# Altium project Light Control BigOne.PrjPcb
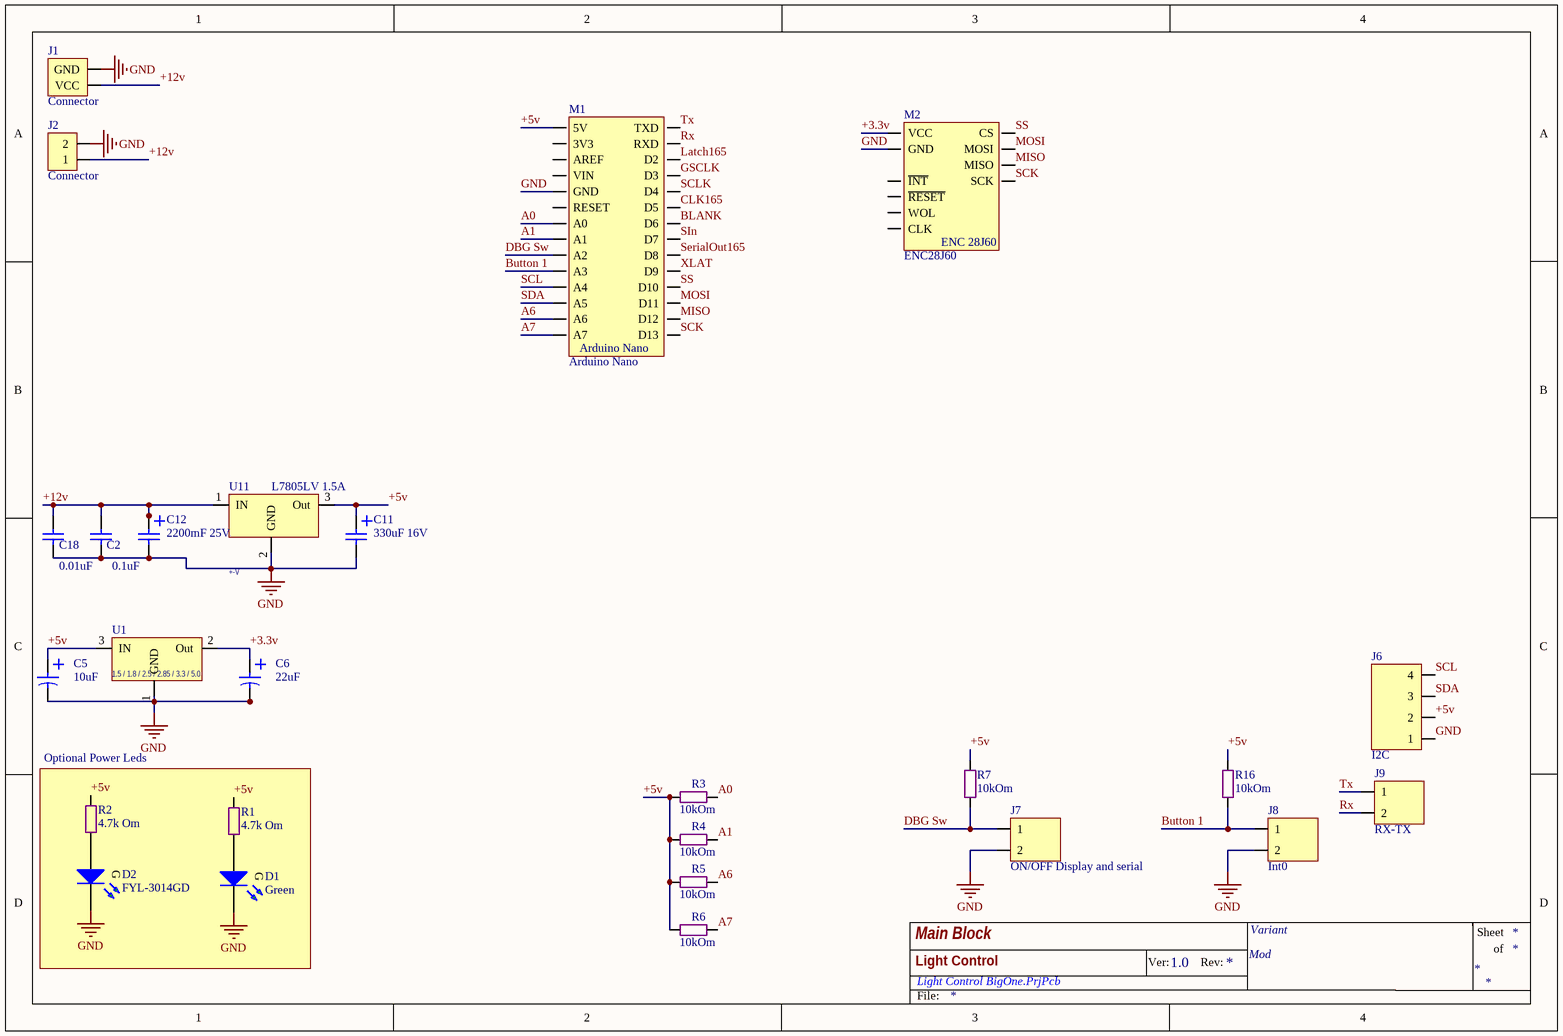
[diagram p0: LC BigOne - MainBlock.SchDoc]
6 sheets, 194 parts. Net scope: global (net labels, ports and power ports of the same name join across sheets).
Board file: LC BigOne.PcbDoc
Sheets:
  LC BigOne - MainBlock.SchDoc
  LC BigOne - TLC5940 driver.SchDoc
  LC BigOne - 165 SerialIn Register (v2).SchDoc
  LC BigOne - Comm Connectors.SchDoc
  LC BigOne - 5.3A MOSFET for TLC5940 2.SchDoc
  LC BigOne - 5.3A MOSFET for TLC5940 3.SchDoc

## Sheet LC BigOne - MainBlock.SchDoc: Main Block
size A4; Version: 1.0; Variant: Variant; Modification: Mod; Project: Light Control; PageSetup: Record=PageOptions|CenterHorizontal=True|CenterVertical=True|PrintScale=0.97|XCorrection=1.00|YCorrection=1.00|PrintKind=1|BorderSize=5000000|LeftOffset=0|BottomOffset=0|Orientation=2|PaperLength=2970|PaperWidth=2100|Scale=100|PaperSource=7|PrintQuality=-4|MediaType=1|DitherType=10|PaperKind=A4|PrintScaleMode=1

### Parts
C2  0.1uF  [SMD 0805 (2012)]
C5  10uF  [SMD 1206 Tantal (3216)]
C6  22uF  [SMD 3528 Tantal (1210)]
C11  330uF 16V  [Cap E p3.5mm D8xH12]
C12  2200mF 25V  [Cap E p5.08mm D10.2mm (3p) R]
C18  0.01uF  [SMD 0805 (2012)]
D1  Green  [LED SMD 0805 Green]
D2  FYL-3014GD  [LED Round 3mm Green]
J1  Connector  [DC Connector]
J2  Connector  [DG301 5mm 2p]
J6  I2C  [Line 2.54 X 4]
J7  ON/OFF Display and serial  [Line 2.54 x 2]
J8  Int0  [Line 2.54 x 2]
J9  RX-TX  [Line 2.54 x 2]
M1  Arduino Nano  [Arduino Nano]
M2  ENC28J60  [ENC28J60 MiNi]
R1  4.7k Om  [SMD 0805 (2012)]
R2  4.7k Om  [SMD 0805 (2012)]
R3  10kOm  [SMD 0805 (2012)]
R4  10kOm  [SMD 0805 (2012)]
R5  10kOm  [SMD 0805 (2012)]
R6  10kOm  [SMD 0805 (2012)]
R7  10kOm  [SMD 0805 (2012)]
R16  10kOm  [SMD 0805 (2012)]
U1  V Out: 1.5 / 1.8 / 2.5 / 2.85 / 3.3 / 5.0  [SOT-223-3 (AMS)]  (hidden comment: AMS1117 1.5 / 1.8 / 2.5 / 2.85 / 3.3 / 5.0)
U11  L7805LV 1.5A  V Out: +-V  [TO220 L]

### Blocks framed on the sheet
Optional Power Leds: D1 D2 R1 R2

### Nets
+5v: C5.VCC C11.1 J6.2 M1.5V R1.1 R2.1 R3.2 R4.2 R5.2 R6.2 R7.2 R16.2 U1.3(IN) U11.3(Out)
GND: C2.2 C5.GND C6.GND C11.2 C12.2 C18.2 D1.K D2.K J1.GND J2.2 J6.1 J7.2 J8.2 M1.GND M2.GND U1.1(GND) U11.2(GND)
+3.3v: C6.VCC M2.VCC U1.2(Out)
+12v: C2.1 C12.1 C18.1 J1.VCC J2.1 U11.1(IN)
A0: M1.A0 R3.1
A1: M1.A1 R4.1
A6: M1.A6 R5.1
A7: M1.A7 R6.1
BLANK: M1.D6
Button 1: J8.1 M1.A3 R16.1
CLK165: M1.D5
DBG Sw: J7.1 M1.A2 R7.1
GSCLK: M1.D3
Latch165: M1.D2
MISO: M1.D12 M2.MISO
MOSI: M1.D11 M2.MOSI
Rx: J9.2 M1.RXD
SCK: M1.D13 M2.SCK
SCL: J6.4 M1.A4
SCLK: M1.D4
SDA: J6.3 M1.A5
SerialOut165: M1.D8
SIn: M1.D7
SS: M1.D10 M2.CS
Tx: J9.1 M1.TXD
XLAT: M1.D9
NetD1_A: D1.A R1.2
NetD2_A: D2.A R2.2

Not connected (* = marked no-connect by the designer): M1 3V3 AREF RESET VIN; M2 CLK INT(~{INT}) RESET(~{RESET}) WOL

### Notes on the sheet
- Ver:
- Rev:
- Sheet
- of
- File:
- (in symbol ENC28J60) ENC 28J60
- (in symbol Led Round 3mm Green) G
- (in symbol Led SMD Green) G

### Library data of the parts
C2 C18 = Cap SMD 0402-1812: Capacitor
C5 C6 = Cap Tantal: Capacitor
C11 = Cap E 330uF x 16V: Capacitor
C12 = Cap E 2200mF x 16V: Capacitor
D1 = Led SMD Green: ?2v ?20mA; Forward Voltage TYP: ?2; Resistor for 5v VCC: 330 Om; Forward Voltage Min: ?; Wave len min/typ: ?; Liminous Min (mcd): ?; Liminous Typ (mcd): ?; Forward Amp (mA): ?; Color: Green
D2 = Led Round 3mm Green: 2.1v 10mA, 15-30mCd; Forward Voltage Max: 2.3; Forward Voltage TYP: 2.1; Wave len min/typ: 570nm; Liminous Typ (mcd): 15-30; Forward Amp (mA): 10; Color: Green; Name: FYL-3014GD
J1 = DC Connector (PJ-002B): DC Connector; Ext Pin Diameter: 5.5mm; Int Pin Diameter: 2.5
J2 = DG301-5.0-2P12: DG301 series
J6 = PLS-4: Vert, Sgl line, Male
J7-J9 = PLS-2: Vert, Sgl line, Male
R1-R7 R16 = Res All Types
U1 = AMS1117_FIX: Voltage Regulator SOT-223-3; I output (A): 1; Max Voltage In (V): 15; t: -40...+125°C; Dropuot: 1-1.3V; Capacitors: In: 10mF; Out: 22mF; Case: SOT-223; Name: AMS1117 1.5 / 1.8 / 2.5 / 2.85 / 3.3 / 5.0; Dtatsheet: https://lib.chipdip.ru/029/DOC001029248.pdf
U11 = KPEH: Linear Voltage Regulator; t: 0...+150°C; Case: TO220; Name: Linear Voltage Regulator
M2 = ENC28J60: ENC28J60 Chip Datasheet: http://lib.chipdip.ru/286/doc000286027.pdf

## Sheet LC BigOne - TLC5940 driver.SchDoc: DBL TLC5940 driver for High load
size A4; Revision: 0; SheetNumber: 1; SheetTotal: 2; Version: 1.0; Variant: Variant; Modification: Mod; Project: Light Control; PageSetup: Record=PageOptions|CenterHorizontal=True|CenterVertical=True|PrintScale=0.97|XCorrection=1.00|YCorrection=1.00|PrintKind=1|BorderSize=5000000|LeftOffset=0|BottomOffset=0|Orientation=2|PaperLength=2970|PaperWidth=2100|Scale=100|PaperSource=7|PrintQuality=-4|MediaType=1|DitherType=10|PaperKind=A4|PrintScaleMode=1
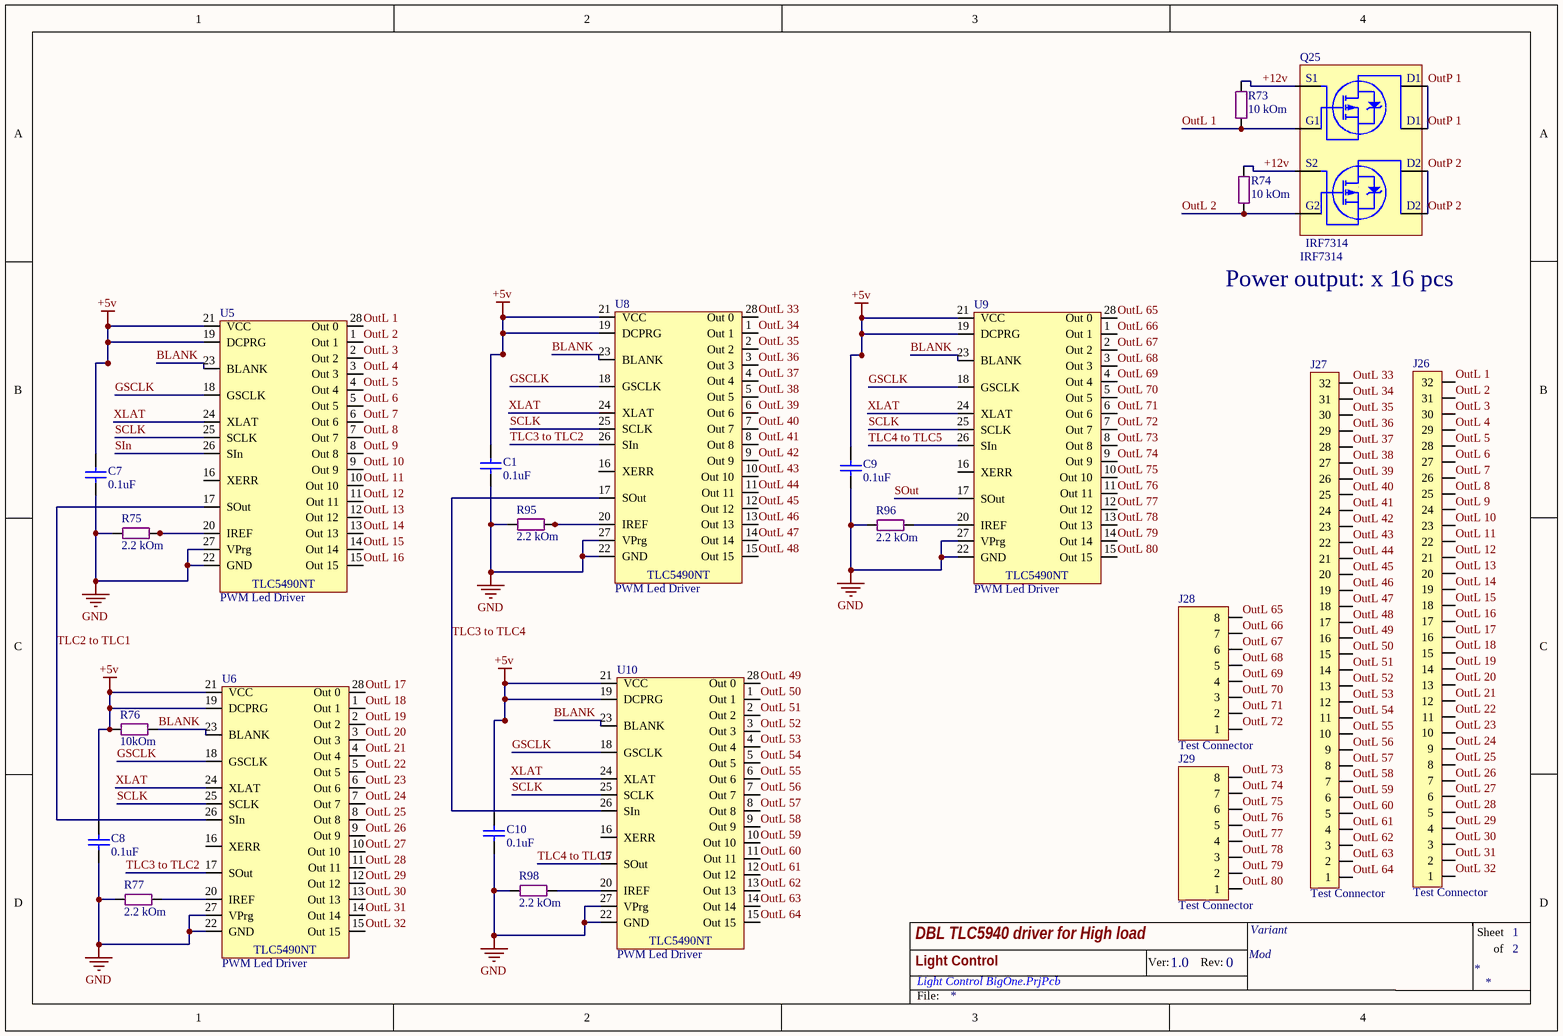
[diagram p1: LC BigOne - TLC5940 driver.SchDoc]

### Parts
C1  0.1uF  [SMD 0805 (2012)]
C7  0.1uF  [SMD 0805 (2012)]
C8  0.1uF  [SMD 0805 (2012)]
C9  0.1uF  [SMD 0805 (2012)]
C10  0.1uF  [SMD 0805 (2012)]
J26  Test Connector  [LINE 2.54 x 32]
J27  Test Connector  [LINE 2.54 x 32]
J28  Test Connector  [Line 2.54 x 8]
J29  Test Connector  [Line 2.54 x 8]
Q25  IRF7314  [SO8]
R73  10 kOm  [SMD 0805 (2012)]
R74  10 kOm  [SMD 0805 (2012)]
R75  2.2 kOm  [SMD 0805 (2012)]
R76  10kOm  [SMD 0805 (2012)]
R77  2.2 kOm  [SMD 0805 (2012)]
R95  2.2 kOm  [SMD 0805 (2012)]
R96  2.2 kOm  [SMD 0805 (2012)]
R98  2.2 kOm  [SMD 0805 (2012)]
U5  PWM Led Driver  [DIP-28 (OVAL)]
U6  PWM Led Driver  [DIP-28 (OVAL)]
U8  PWM Led Driver  [DIP-28 (OVAL)]
U9  PWM Led Driver  [DIP-28 (OVAL)]
U10  PWM Led Driver  [DIP-28 (OVAL)]

### Nets
+5v: C1.1 C7.1 C8.1 C9.1 C10.1 R76.1 U5.19(DCPRG) U5.21(VCC) U6.19(DCPRG) U6.21(VCC) U8.19(DCPRG) U8.21(VCC) U9.19(DCPRG) U9.21(VCC) U10.19(DCPRG) U10.21(VCC)
GND: C1.2 C7.2 C8.2 C9.2 C10.2 R75.2 R77.2 R95.2 R96.2 R98.2 U5.22(GND) U5.27(VPrg) U6.22(GND) U6.27(VPrg) U8.22(GND) U8.27(VPrg) U9.22(GND) U9.27(VPrg) U10.22(GND) U10.27(VPrg)
+12v: Q25.1(S) Q25.3(S) R73.2 R74.2
BLANK: R76.2 U5.23(BLANK) U6.23(BLANK) U8.23(BLANK) U9.23(BLANK) U10.23(BLANK)
GSCLK: U5.18(GSCLK) U6.18(GSCLK) U8.18(GSCLK) U9.18(GSCLK) U10.18(GSCLK)
OutL 1: J26.32 Q25.2(G) R73.1 U5.28(Out_0)
OutL 2: J26.31 Q25.4(G) R74.1 U5.1(Out_1)
OutL 3: J26.30 U5.2(Out_2)
OutL 4: J26.29 U5.3(Out_3)
OutL 5: J26.28 U5.4(Out_4)
OutL 6: J26.27 U5.5(Out_5)
OutL 7: J26.26 U5.6(Out_6)
OutL 8: J26.25 U5.7(Out_7)
OutL 9: J26.24 U5.8(Out_8)
OutL 10: J26.23 U5.9(Out_9)
OutL 11: J26.22 U5.10(Out_10)
OutL 12: J26.21 U5.11(Out_11)
OutL 13: J26.20 U5.12(Out_12)
OutL 14: J26.19 U5.13(Out_13)
OutL 15: J26.18 U5.14(Out_14)
OutL 16: J26.17 U5.15(Out_15)
OutL 17: J26.16 U6.28(Out_0)
OutL 18: J26.15 U6.1(Out_1)
OutL 19: J26.14 U6.2(Out_2)
OutL 20: J26.13 U6.3(Out_3)
OutL 21: J26.12 U6.4(Out_4)
OutL 22: J26.11 U6.5(Out_5)
OutL 23: J26.10 U6.6(Out_6)
OutL 24: J26.9 U6.7(Out_7)
OutL 25: J26.8 U6.8(Out_8)
OutL 26: J26.7 U6.9(Out_9)
OutL 27: J26.6 U6.10(Out_10)
OutL 28: J26.5 U6.11(Out_11)
OutL 29: J26.4 U6.12(Out_12)
OutL 30: J26.3 U6.13(Out_13)
OutL 31: J26.2 U6.14(Out_14)
OutL 32: J26.1 U6.15(Out_15)
OutL 33: J27.32 U8.28(Out_0)
OutL 34: J27.31 U8.1(Out_1)
OutL 35: J27.30 U8.2(Out_2)
OutL 36: J27.29 U8.3(Out_3)
OutL 37: J27.28 U8.4(Out_4)
OutL 38: J27.27 U8.5(Out_5)
OutL 39: J27.26 U8.6(Out_6)
OutL 40: J27.25 U8.7(Out_7)
OutL 41: J27.24 U8.8(Out_8)
OutL 42: J27.23 U8.9(Out_9)
OutL 43: J27.22 U8.10(Out_10)
OutL 44: J27.21 U8.11(Out_11)
OutL 45: J27.20 U8.12(Out_12)
OutL 46: J27.19 U8.13(Out_13)
OutL 47: J27.18 U8.14(Out_14)
OutL 48: J27.17 U8.15(Out_15)
OutL 49: J27.16 U10.28(Out_0)
OutL 50: J27.15 U10.1(Out_1)
OutL 51: J27.14 U10.2(Out_2)
OutL 52: J27.13 U10.3(Out_3)
OutL 53: J27.12 U10.4(Out_4)
OutL 54: J27.11 U10.5(Out_5)
OutL 55: J27.10 U10.6(Out_6)
OutL 56: J27.9 U10.7(Out_7)
OutL 57: J27.8 U10.8(Out_8)
OutL 58: J27.7 U10.9(Out_9)
OutL 59: J27.6 U10.10(Out_10)
OutL 60: J27.5 U10.11(Out_11)
OutL 61: J27.4 U10.12(Out_12)
OutL 62: J27.3 U10.13(Out_13)
OutL 63: J27.2 U10.14(Out_14)
OutL 64: J27.1 U10.15(Out_15)
OutL 65: J28.8 U9.28(Out_0)
OutL 66: J28.7 U9.1(Out_1)
OutL 67: J28.6 U9.2(Out_2)
OutL 68: J28.5 U9.3(Out_3)
OutL 69: J28.4 U9.4(Out_4)
OutL 70: J28.3 U9.5(Out_5)
OutL 71: J28.2 U9.6(Out_6)
OutL 72: J28.1 U9.7(Out_7)
OutL 73: J29.8 U9.8(Out_8)
OutL 74: J29.7 U9.9(Out_9)
OutL 75: J29.6 U9.10(Out_10)
OutL 76: J29.5 U9.11(Out_11)
OutL 77: J29.4 U9.12(Out_12)
OutL 78: J29.3 U9.13(Out_13)
OutL 79: J29.2 U9.14(Out_14)
OutL 80: J29.1 U9.15(Out_15)
OutP 1: Q25.7(D) Q25.8(D)
OutP 2: Q25.5(D) Q25.6(D)
SCLK: U5.25(SCLK) U6.25(SCLK) U8.25(SCLK) U9.25(SCLK) U10.25(SCLK)
SIn: U5.26(SIn)
SOut: U9.17(SOut)
TLC2 to TLC1: U5.17(SOut) U6.26(SIn)
TLC3 to TLC2: U6.17(SOut) U8.26(SIn)
TLC3 to TLC4: U8.17(SOut) U10.26(SIn)
TLC4 to TLC5: U9.26(SIn) U10.17(SOut)
XLAT: U5.24(XLAT) U6.24(XLAT) U8.24(XLAT) U9.24(XLAT) U10.24(XLAT)
NetR75_1: R75.1 U5.20(IREF)
NetR77_1: R77.1 U6.20(IREF)
NetR95_1: R95.1 U8.20(IREF)
NetR96_1: R96.1 U9.20(IREF)
NetR98_1: R98.1 U10.20(IREF)

Not connected (* = marked no-connect by the designer): U5 16(XERR); U6 16(XERR); U8 16(XERR); U9 16(XERR); U10 16(XERR)

### Notes on the sheet
- Power output: x 16 pcs
- Ver:
- Rev:
- Sheet
- of
- File:
- (in symbol IRF7314) S1; D1; G1; S2; D2; G2
- (in symbol TLC5940) TLC5490NT

### Library data of the parts
C1 C7-C10 = Cap SMD 0402-1812: Capacitor
J26 J27 = PLS-32: Vert, Sgl line, Male
J28 J29 = PLS-8: Vert, Sgl line, Male
Q25 = IRF7314: Dual P-Ch  20V - 0.058Ω - 5.3A; Monufacturer: IOR; RDS Сопротивление Сток-Исток: 0.058 Om; I d - Drain current (continuous) at TC = 100°C: 4.3 A; VGS Порог Открытия: -0.7 V; VGS Макс напр на гейте: +-12 V; C ISS Входная емкость: 780 pF; C OSS Выходная емкость: 470 pF; V DSS (v): 20V; I d - Drain current (continuous) at TC = 25°C: 5.3 A; Name: IRF7314; Datasheet: http://tec.org.ru/_bd/2/277_IRF7314-IR.pdf; URL: http://tec.org.ru/board/49-1-0-277
R73-R77 R95 R96 R98 = Res All Types
U5 U6 U8-U10 = TLC5940: 16-Channel LED Driver With DOT Correction and Grayscale PWM Control; DataSheet: http://www.ti.com/lit/ds/symlink/tlc5940.pdf

## Sheet LC BigOne - 165 SerialIn Register (v2).SchDoc: DBL 165 Serial In Register
size A4; Organization: Controlled by GND; Revision: 0; SheetNumber: 1; SheetTotal: 1; Version: 2.0s; Variant: Controlled by GND; Modification: On IRF5850 Mosfet; Project: Light Control; PageSetup: Record=PageOptions|CenterHorizontal=True|CenterVertical=True|PrintScale=0.97|XCorrection=1.00|YCorrection=1.00|PrintKind=1|BorderSize=5000000|LeftOffset=0|BottomOffset=0|Orientation=2|PaperLength=2970|PaperWidth=2100|Scale=100|PaperSource=7|PrintQuality=-4|MediaType=1|DitherType=10|PaperKind=A4|PrintScaleMode=1; DocumentName: DBL 165 Serial In Register; ProjectName: LightControl
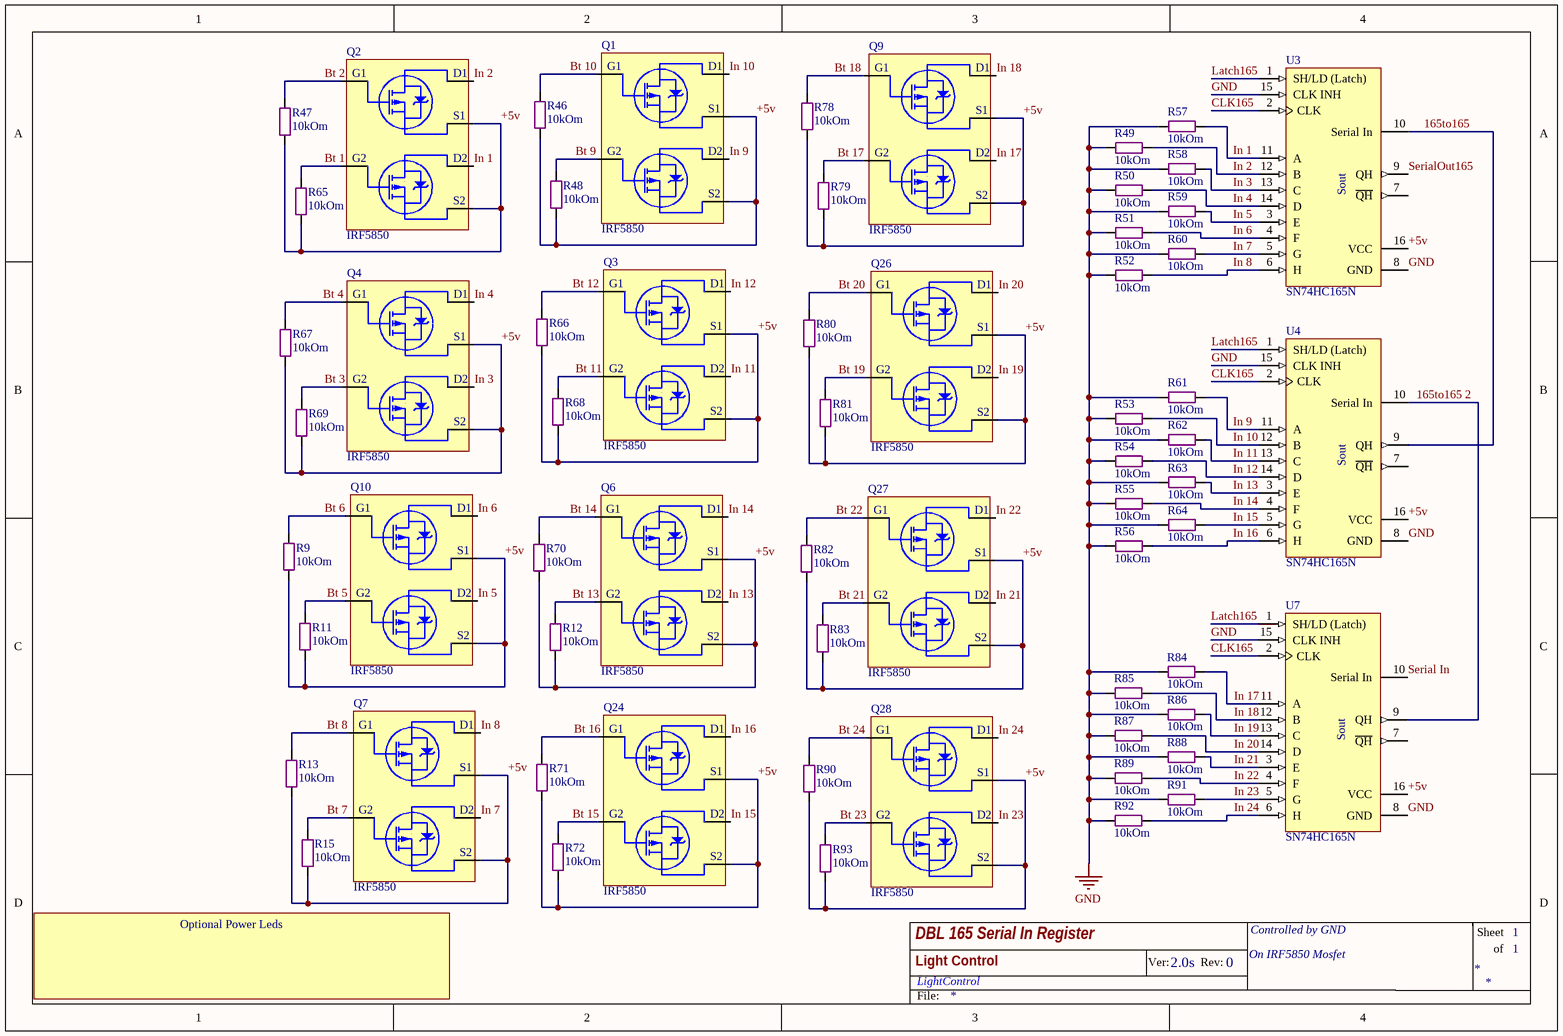
[diagram p2: LC BigOne - 165 SerialIn Register (v2).SchDoc]

### Parts
Q1  IRF5850  [TSOP-6]
Q2  IRF5850  [TSOP-6]
Q3  IRF5850  [TSOP-6]
Q4  IRF5850  [TSOP-6]
Q6  IRF5850  [TSOP-6]
Q7  IRF5850  [TSOP-6]
Q9  IRF5850  [TSOP-6]
Q10  IRF5850  [TSOP-6]
Q24  IRF5850  [TSOP-6]
Q26  IRF5850  [TSOP-6]
Q27  IRF5850  [TSOP-6]
Q28  IRF5850  [TSOP-6]
R9  10kOm  [SMD 0805 (2012)]
R11  10kOm  [SMD 0805 (2012)]
R12  10kOm  [SMD 0805 (2012)]
R13  10kOm  [SMD 0805 (2012)]
R15  10kOm  [SMD 0805 (2012)]
R46  10kOm  [SMD 0805 (2012)]
R47  10kOm  [SMD 0805 (2012)]
R48  10kOm  [SMD 0805 (2012)]
R49  10kOm  [SMD 0805 (2012)]
R50  10kOm  [SMD 0805 (2012)]
R51  10kOm  [SMD 0805 (2012)]
R52  10kOm  [SMD 0805 (2012)]
R53  10kOm  [SMD 0805 (2012)]
R54  10kOm  [SMD 0805 (2012)]
R55  10kOm  [SMD 0805 (2012)]
R56  10kOm  [SMD 0805 (2012)]
R57  10kOm  [SMD 0805 (2012)]
R58  10kOm  [SMD 0805 (2012)]
R59  10kOm  [SMD 0805 (2012)]
R60  10kOm  [SMD 0805 (2012)]
R61  10kOm  [SMD 0805 (2012)]
R62  10kOm  [SMD 0805 (2012)]
R63  10kOm  [SMD 0805 (2012)]
R64  10kOm  [SMD 0805 (2012)]
R65  10kOm  [SMD 0805 (2012)]
R66  10kOm  [SMD 0805 (2012)]
R67  10kOm  [SMD 0805 (2012)]
R68  10kOm  [SMD 0805 (2012)]
R69  10kOm  [SMD 0805 (2012)]
R70  10kOm  [SMD 0805 (2012)]
R71  10kOm  [SMD 0805 (2012)]
R72  10kOm  [SMD 0805 (2012)]
R78  10kOm  [SMD 0805 (2012)]
R79  10kOm  [SMD 0805 (2012)]
R80  10kOm  [SMD 0805 (2012)]
R81  10kOm  [SMD 0805 (2012)]
R82  10kOm  [SMD 0805 (2012)]
R83  10kOm  [SMD 0805 (2012)]
R84  10kOm  [SMD 0805 (2012)]
R85  10kOm  [SMD 0805 (2012)]
R86  10kOm  [SMD 0805 (2012)]
R87  10kOm  [SMD 0805 (2012)]
R88  10kOm  [SMD 0805 (2012)]
R89  10kOm  [SMD 0805 (2012)]
R90  10kOm  [SMD 0805 (2012)]
R91  10kOm  [SMD 0805 (2012)]
R92  10kOm  [SMD 0805 (2012)]
R93  10kOm  [SMD 0805 (2012)]
U3  SN74HC165N  [DIP-16]
U4  SN74HC165N  [DIP-16]
U7  SN74HC165N  [DIP-16]

### Nets
+5v: Q1.2(S2) Q1.5(S1) Q2.2(S2) Q2.5(S1) Q3.2(S2) Q3.5(S1) Q4.2(S2) Q4.5(S1) Q6.2(S2) Q6.5(S1) Q7.2(S2) Q7.5(S1) Q9.2(S2) Q9.5(S1) Q10.2(S2) Q10.5(S1) Q24.2(S2) Q24.5(S1) Q26.2(S2) Q26.5(S1) Q27.2(S2) Q27.5(S1) Q28.2(S2) Q28.5(S1) R9.2 R11.2 R12.2 R13.2 R15.2 R46.2 R47.2 R48.2 R65.2 R66.2 R67.2 R68.2 R69.2 R70.2 R71.2 R72.2 R78.2 R79.2 R80.2 R81.2 R82.2 R83.2 R90.2 R93.2 U3.16(VCC) U4.16(VCC) U7.16(VCC)
GND: R49.1 R50.1 R51.1 R52.1 R53.1 R54.1 R55.1 R56.1 R57.1 R58.1 R59.1 R60.1 R61.1 R62.1 R63.1 R64.1 R84.1 R85.1 R86.1 R87.1 R88.1 R89.1 R91.1 R92.1 U3.8(GND) U3.15(CLK_INH) U4.8(GND) U4.15(CLK_INH) U7.8(GND) U7.15(CLK_INH)
165to165: U3.10(Serial_In) U4.9(QH)
165to165 2: U4.10(Serial_In) U7.9(QH)
Bt 1: Q2.3(G2) R65.1
Bt 2: Q2.1(G1) R47.1
Bt 3: Q4.3(G2) R69.1
Bt 4: Q4.1(G1) R67.1
Bt 5: Q10.3(G2) R11.1
Bt 6: Q10.1(G1) R9.1
Bt 7: Q7.3(G2) R15.1
Bt 8: Q7.1(G1) R13.1
Bt 9: Q1.3(G2) R48.1
Bt 10: Q1.1(G1) R46.1
Bt 11: Q3.3(G2) R68.1
Bt 12: Q3.1(G1) R66.1
Bt 13: Q6.3(G2) R12.1
Bt 14: Q6.1(G1) R70.1
Bt 15: Q24.3(G2) R72.1
Bt 16: Q24.1(G1) R71.1
Bt 17: Q9.3(G2) R79.1
Bt 18: Q9.1(G1) R78.1
Bt 19: Q26.3(G2) R81.1
Bt 20: Q26.1(G1) R80.1
Bt 21: Q27.3(G2) R83.1
Bt 22: Q27.1(G1) R82.1
Bt 23: Q28.3(G2) R93.1
Bt 24: Q28.1(G1) R90.1
CLK165: U3.2(CLK) U4.2(CLK) U7.2(CLK)
In 1: Q2.4(D2) R57.2 U3.11(A)
In 2: Q2.6(D1) R49.2 U3.12(B)
In 3: Q4.4(D2) R58.2 U3.13(C)
In 4: Q4.6(D1) R50.2 U3.14(D)
In 5: Q10.4(D2) R59.2 U3.3(E)
In 6: Q10.6(D1) R51.2 U3.4(F)
In 7: Q7.4(D2) R60.2 U3.5(G)
In 8: Q7.6(D1) R52.2 U3.6(H)
In 9: Q1.4(D2) R61.2 U4.11(A)
In 10: Q1.6(D1) R53.2 U4.12(B)
In 11: Q3.4(D2) R62.2 U4.13(C)
In 12: Q3.6(D1) R54.2 U4.14(D)
In 13: Q6.4(D2) R63.2 U4.3(E)
In 14: Q6.6(D1) R55.2 U4.4(F)
In 15: Q24.4(D2) R64.2 U4.5(G)
In 16: Q24.6(D1) R56.2 U4.6(H)
In 17: Q9.4(D2) R84.2 U7.11(A)
In 18: Q9.6(D1) R85.2 U7.12(B)
In 19: Q26.4(D2) R86.2 U7.13(C)
In 20: Q26.6(D1) R87.2 U7.14(D)
In 21: Q27.4(D2) R88.2 U7.3(E)
In 22: Q27.6(D1) R89.2 U7.4(F)
In 23: Q28.4(D2) R91.2 U7.5(G)
In 24: Q28.6(D1) R92.2 U7.6(H)
Latch165: U3.1(SH/LD_(Latch)) U4.1(SH/LD_(Latch)) U7.1(SH/LD_(Latch))
Serial In: U7.10(Serial_In)
SerialOut165: U3.9(QH)

Not connected (* = marked no-connect by the designer): U3 7(~{QH}); U4 7(~{QH}); U7 7(~{QH})

### Notes on the sheet
- Optional Power Leds
- Ver:
- Rev:
- Sheet
- of
- File:
- (in symbol SN74HC165N) Sout

### Library data of the parts
Q1-Q4 Q6 Q7 Q9 Q10 Q24 Q26-Q28 = IRF5850: Dual P-Ch  20V - 0.135Ω - 2.2A; Monufacturer: IOR; V DSS (v): -20 V; RDS Сопротивление Сток-Исток: 0.135 Om; I d - Drain current (continuous) at TC = 70°C: 1.8 A; VGS Порог Открытия: -0.45...-1.2 V; VGS Макс напр на гейте: +-12 V; C ISS Входная емкость: 320 pF; C OSS Выходная емкость: 56 pF; I d - Drain current (continuous) at TC = 25°C: 2.2 A; Name: IRF5850; Datasheet: http://tec.org.ru/_bd/4/490_IRF5850.pdf; URL: http://tec.org.ru/board/irf5850/49-1-0-490
R9 R11-R13 R15 R46-R72 R78-R93 = Res All Types
U3 U4 U7 = SN74HC165N: 8-Bit Parallel-Load Shift Register; Published: 8-Jun-2000; LatestRevisionDate: 04-Mar-2005; LatestRevisionNote: Stylized 3D Model Added.; DatasheetVersion: May-1997; PackageVersion: Oct-1995; PackageReference: N016; Publisher: Altium Limited; PackageDescription: DIP; 16 Leads; Row Spacing 7.62 mm; Pitch 2.54 mm; Code_JEDEC: MS-001-BB; ComponentLink1Description: Manufacturer Link; ComponentLink1URL: http://www.ti.com/; ComponentLink2Description: Datasheet; ComponentLink2URL: http://www-s.ti.com/sc/ds/sn74hc165.pdf

## Sheet LC BigOne - Comm Connectors.SchDoc
size A4; Version: ver; Variant: Variant; Modification: Mod; Project: Project Name
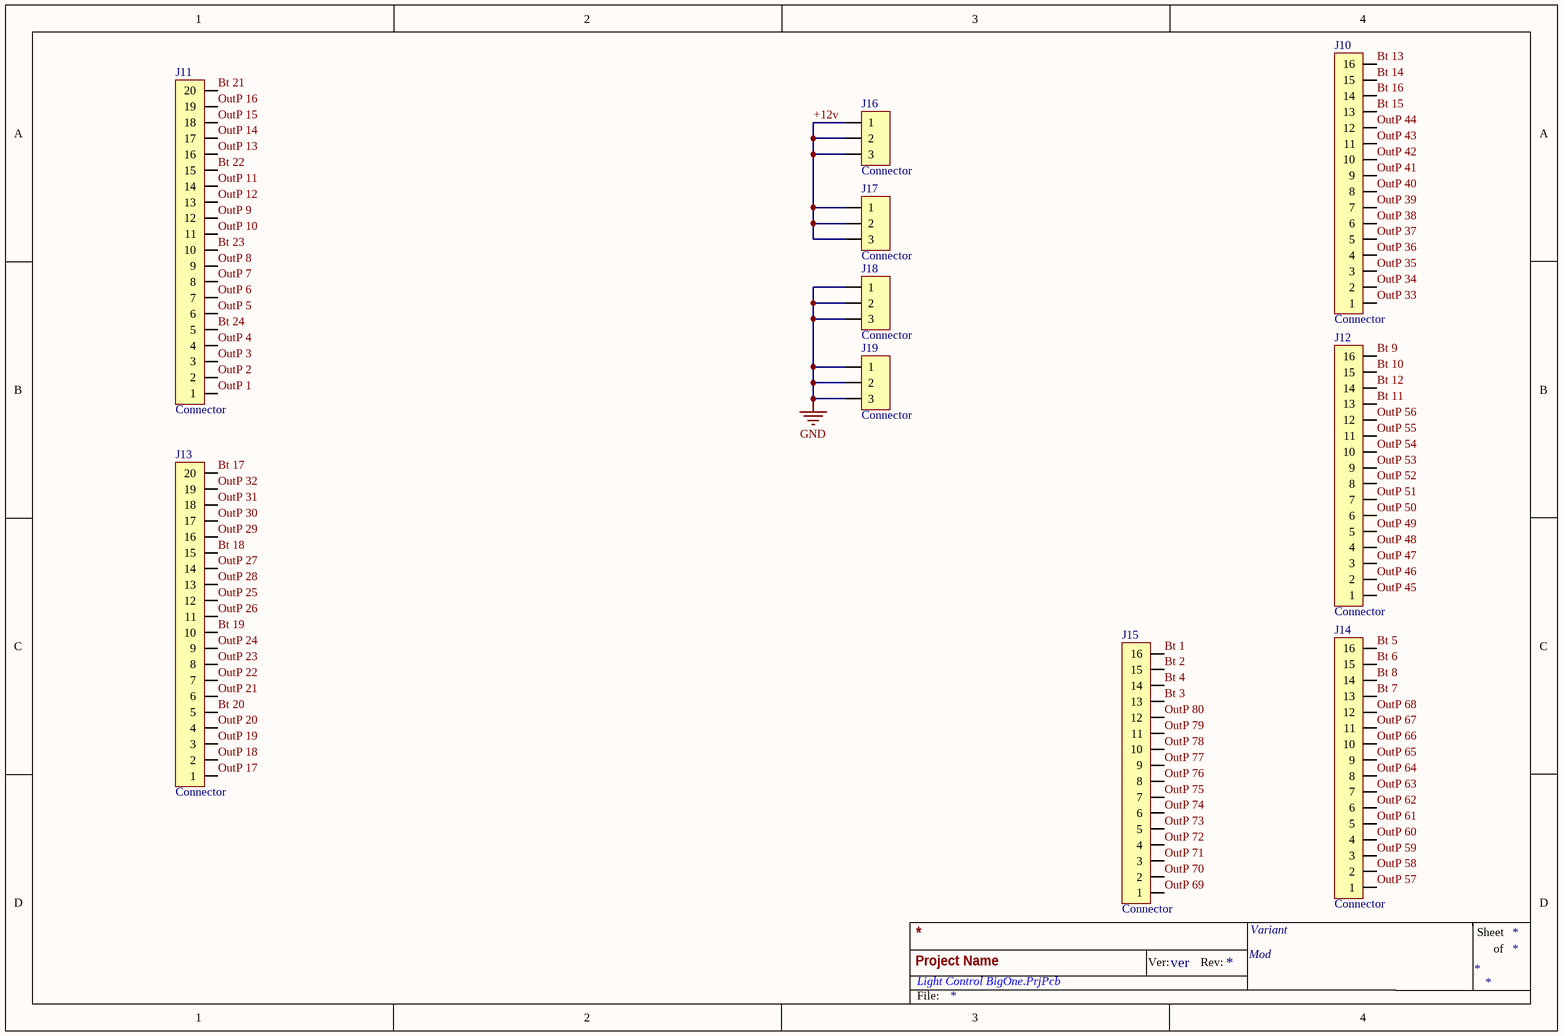
[diagram p3: LC BigOne - Comm Connectors.SchDoc]

### Parts
J10  Connector  [LINE 2.54 x 16D (2 x 8) BH]
J11  Connector  [LINE 2.54 x 20D (2 x 10) - BH]
J12  Connector  [LINE 2.54 x 16D (2 x 8) BH]
J13  Connector  [LINE 2.54 x 20D (2 x 10) - BH]
J14  Connector  [LINE 2.54 x 16D (2 x 8) BH]
J15  Connector  [LINE 2.54 x 16D (2 x 8) BH]
J16  Connector  [DG301 5mm 3p]
J17  Connector  [DG301 5mm 3p]
J18  Connector  [DG301 5mm 3p]
J19  Connector  [DG301 5mm 3p]

### Nets
GND: J18.1 J18.2 J18.3 J19.1 J19.2 J19.3
+12v: J16.1 J16.2 J16.3 J17.1 J17.2 J17.3
Bt 1: J15.16
Bt 2: J15.15
Bt 3: J15.13
Bt 4: J15.14
Bt 5: J14.16
Bt 6: J14.15
Bt 7: J14.13
Bt 8: J14.14
Bt 9: J12.16
Bt 10: J12.15
Bt 11: J12.13
Bt 12: J12.14
Bt 13: J10.16
Bt 14: J10.15
Bt 15: J10.13
Bt 16: J10.14
Bt 17: J13.20
Bt 18: J13.15
Bt 19: J13.10
Bt 20: J13.5
Bt 21: J11.20
Bt 22: J11.15
Bt 23: J11.10
Bt 24: J11.5
OutP 1: J11.1
OutP 2: J11.2
OutP 3: J11.3
OutP 4: J11.4
OutP 5: J11.6
OutP 6: J11.7
OutP 7: J11.8
OutP 8: J11.9
OutP 9: J11.12
OutP 10: J11.11
OutP 11: J11.14
OutP 12: J11.13
OutP 13: J11.16
OutP 14: J11.17
OutP 15: J11.18
OutP 16: J11.19
OutP 17: J13.1
OutP 18: J13.2
OutP 19: J13.3
OutP 20: J13.4
OutP 21: J13.6
OutP 22: J13.7
OutP 23: J13.8
OutP 24: J13.9
OutP 25: J13.12
OutP 26: J13.11
OutP 27: J13.14
OutP 28: J13.13
OutP 29: J13.16
OutP 30: J13.17
OutP 31: J13.18
OutP 32: J13.19
OutP 33: J10.1
OutP 34: J10.2
OutP 35: J10.3
OutP 36: J10.4
OutP 37: J10.5
OutP 38: J10.6
OutP 39: J10.7
OutP 40: J10.8
OutP 41: J10.9
OutP 42: J10.10
OutP 43: J10.11
OutP 44: J10.12
OutP 45: J12.1
OutP 46: J12.2
OutP 47: J12.3
OutP 48: J12.4
OutP 49: J12.5
OutP 50: J12.6
OutP 51: J12.7
OutP 52: J12.8
OutP 53: J12.9
OutP 54: J12.10
OutP 55: J12.11
OutP 56: J12.12
OutP 57: J14.1
OutP 58: J14.2
OutP 59: J14.3
OutP 60: J14.4
OutP 61: J14.5
OutP 62: J14.6
OutP 63: J14.7
OutP 64: J14.8
OutP 65: J14.9
OutP 66: J14.10
OutP 67: J14.11
OutP 68: J14.12
OutP 69: J15.1
OutP 70: J15.2
OutP 71: J15.3
OutP 72: J15.4
OutP 73: J15.5
OutP 74: J15.6
OutP 75: J15.7
OutP 76: J15.8
OutP 77: J15.9
OutP 78: J15.10
OutP 79: J15.11
OutP 80: J15.12

### Notes on the sheet
- Ver:
- Rev:
- Sheet
- of
- File:

### Library data of the parts
J10 J12 J14 J15 = PLD-16 (2 x 8): Vert, Dbl line, Male
J11 J13 = PLD-20 (2 x 10): Vert, Dbl line, Male
J16-J19 = DG301-5.0-3P12: DG301 series

## Sheet LC BigOne - 5.3A MOSFET for TLC5940 2.SchDoc: DBL TLC5940 driver for High load - 5.3A MOSFET
size A4; Revision: 0; SheetNumber: 2; SheetTotal: 2; Version: 1.0; Variant: 5.3 A MOSFET; Modification: Mod; Project: Light Control
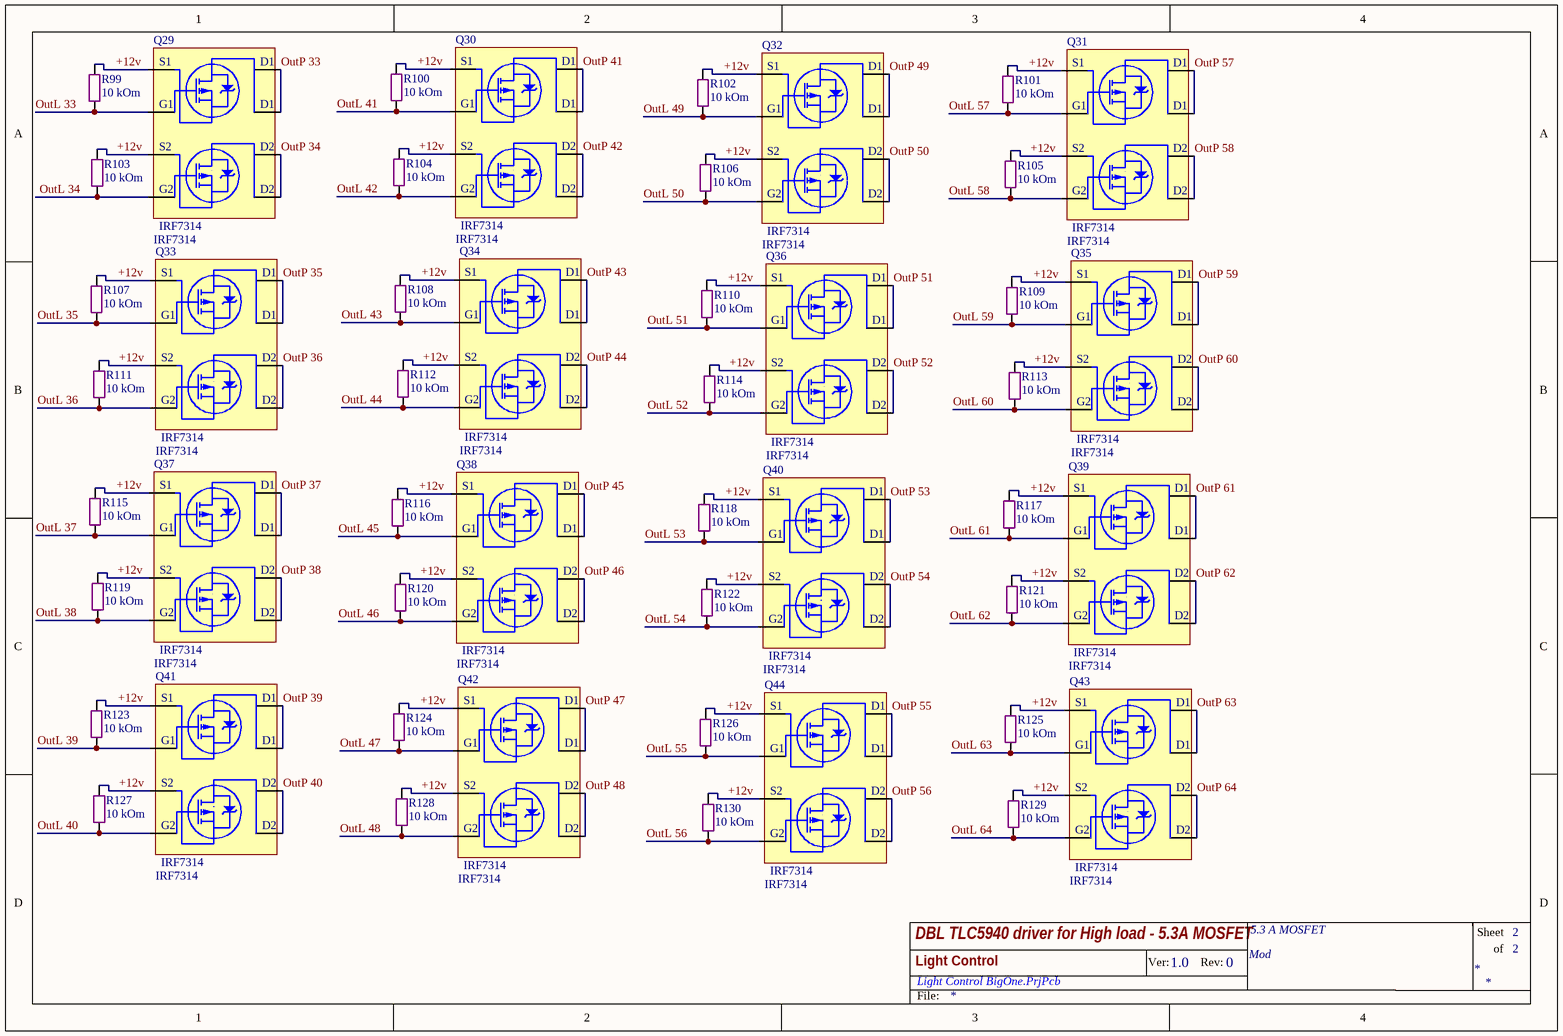
[diagram p4: LC BigOne - 5.3A MOSFET for TLC5940 2.SchDoc]

### Parts
Q29  IRF7314  [SO8]
Q30  IRF7314  [SO8]
Q31  IRF7314  [SO8]
Q32  IRF7314  [SO8]
Q33  IRF7314  [SO8]
Q34  IRF7314  [SO8]
Q35  IRF7314  [SO8]
Q36  IRF7314  [SO8]
Q37  IRF7314  [SO8]
Q38  IRF7314  [SO8]
Q39  IRF7314  [SO8]
Q40  IRF7314  [SO8]
Q41  IRF7314  [SO8]
Q42  IRF7314  [SO8]
Q43  IRF7314  [SO8]
Q44  IRF7314  [SO8]
R99  10 kOm  [SMD 0805 (2012)]
R100  10 kOm  [SMD 0805 (2012)]
R101  10 kOm  [SMD 0805 (2012)]
R102  10 kOm  [SMD 0805 (2012)]
R103  10 kOm  [SMD 0805 (2012)]
R104  10 kOm  [SMD 0805 (2012)]
R105  10 kOm  [SMD 0805 (2012)]
R106  10 kOm  [SMD 0805 (2012)]
R107  10 kOm  [SMD 0805 (2012)]
R108  10 kOm  [SMD 0805 (2012)]
R109  10 kOm  [SMD 0805 (2012)]
R110  10 kOm  [SMD 0805 (2012)]
R111  10 kOm  [SMD 0805 (2012)]
R112  10 kOm  [SMD 0805 (2012)]
R113  10 kOm  [SMD 0805 (2012)]
R114  10 kOm  [SMD 0805 (2012)]
R115  10 kOm  [SMD 0805 (2012)]
R116  10 kOm  [SMD 0805 (2012)]
R117  10 kOm  [SMD 0805 (2012)]
R118  10 kOm  [SMD 0805 (2012)]
R119  10 kOm  [SMD 0805 (2012)]
R120  10 kOm  [SMD 0805 (2012)]
R121  10 kOm  [SMD 0805 (2012)]
R122  10 kOm  [SMD 0805 (2012)]
R123  10 kOm  [SMD 0805 (2012)]
R124  10 kOm  [SMD 0805 (2012)]
R125  10 kOm  [SMD 0805 (2012)]
R126  10 kOm  [SMD 0805 (2012)]
R127  10 kOm  [SMD 0805 (2012)]
R128  10 kOm  [SMD 0805 (2012)]
R129  10 kOm  [SMD 0805 (2012)]
R130  10 kOm  [SMD 0805 (2012)]

### Nets
+12v: Q29.1(S) Q29.3(S) Q30.1(S) Q30.3(S) Q31.1(S) Q31.3(S) Q32.1(S) Q32.3(S) Q33.1(S) Q33.3(S) Q34.1(S) Q34.3(S) Q35.1(S) Q35.3(S) Q36.1(S) Q36.3(S) Q37.1(S) Q37.3(S) Q38.1(S) Q38.3(S) Q39.1(S) Q39.3(S) Q40.1(S) Q40.3(S) Q41.1(S) Q41.3(S) Q42.1(S) Q42.3(S) Q43.1(S) Q43.3(S) Q44.1(S) Q44.3(S) R99.2 R100.2 R101.2 R102.2 R103.2 R104.2 R105.2 R106.2 R107.2 R108.2 R109.2 R110.2 R111.2 R112.2 R113.2 R114.2 R115.2 R116.2 R117.2 R118.2 R119.2 R120.2 R121.2 R122.2 R123.2 R124.2 R125.2 R126.2 R127.2 R128.2 R129.2 R130.2
OutL 33: Q29.2(G) R99.1
OutL 34: Q29.4(G) R103.1
OutL 35: Q33.2(G) R107.1
OutL 36: Q33.4(G) R111.1
OutL 37: Q37.2(G) R115.1
OutL 38: Q37.4(G) R119.1
OutL 39: Q41.2(G) R123.1
OutL 40: Q41.4(G) R127.1
OutL 41: Q30.2(G) R100.1
OutL 42: Q30.4(G) R104.1
OutL 43: Q34.2(G) R108.1
OutL 44: Q34.4(G) R112.1
OutL 45: Q38.2(G) R116.1
OutL 46: Q38.4(G) R120.1
OutL 47: Q42.2(G) R124.1
OutL 48: Q42.4(G) R128.1
OutL 49: Q32.2(G) R102.1
OutL 50: Q32.4(G) R106.1
OutL 51: Q36.2(G) R110.1
OutL 52: Q36.4(G) R114.1
OutL 53: Q40.2(G) R118.1
OutL 54: Q40.4(G) R122.1
OutL 55: Q44.2(G) R126.1
OutL 56: Q44.4(G) R130.1
OutL 57: Q31.2(G) R101.1
OutL 58: Q31.4(G) R105.1
OutL 59: Q35.2(G) R109.1
OutL 60: Q35.4(G) R113.1
OutL 61: Q39.2(G) R117.1
OutL 62: Q39.4(G) R121.1
OutL 63: Q43.2(G) R125.1
OutL 64: Q43.4(G) R129.1
OutP 33: Q29.7(D) Q29.8(D)
OutP 34: Q29.5(D) Q29.6(D)
OutP 35: Q33.7(D) Q33.8(D)
OutP 36: Q33.5(D) Q33.6(D)
OutP 37: Q37.7(D) Q37.8(D)
OutP 38: Q37.5(D) Q37.6(D)
OutP 39: Q41.7(D) Q41.8(D)
OutP 40: Q41.5(D) Q41.6(D)
OutP 41: Q30.7(D) Q30.8(D)
OutP 42: Q30.5(D) Q30.6(D)
OutP 43: Q34.7(D) Q34.8(D)
OutP 44: Q34.5(D) Q34.6(D)
OutP 45: Q38.7(D) Q38.8(D)
OutP 46: Q38.5(D) Q38.6(D)
OutP 47: Q42.7(D) Q42.8(D)
OutP 48: Q42.5(D) Q42.6(D)
OutP 49: Q32.7(D) Q32.8(D)
OutP 50: Q32.5(D) Q32.6(D)
OutP 51: Q36.7(D) Q36.8(D)
OutP 52: Q36.5(D) Q36.6(D)
OutP 53: Q40.7(D) Q40.8(D)
OutP 54: Q40.5(D) Q40.6(D)
OutP 55: Q44.7(D) Q44.8(D)
OutP 56: Q44.5(D) Q44.6(D)
OutP 57: Q31.7(D) Q31.8(D)
OutP 58: Q31.5(D) Q31.6(D)
OutP 59: Q35.7(D) Q35.8(D)
OutP 60: Q35.5(D) Q35.6(D)
OutP 61: Q39.7(D) Q39.8(D)
OutP 62: Q39.5(D) Q39.6(D)
OutP 63: Q43.7(D) Q43.8(D)
OutP 64: Q43.5(D) Q43.6(D)

### Notes on the sheet
- Ver:
- Rev:
- Sheet
- of
- File:
- (in symbol IRF7314) S1; D1; G1; S2; D2; G2

### Library data of the parts
Q29-Q44 = IRF7314: as Q25 on sheet LC BigOne - TLC5940 driver; V DSS (v): 20V; I d - Drain current (continuous) at TC = 25°C: 5.3 A; Name: IRF7314; Datasheet: http://tec.org.ru/_bd/2/277_IRF7314-IR.pdf; URL: http://tec.org.ru/board/49-1-0-277
R99-R130 = Res All Types

## Sheet LC BigOne - 5.3A MOSFET for TLC5940 3.SchDoc: DBL TLC5940 driver for High load - 5.3A MOSFET
size A4; Revision: 0; SheetNumber: 2; SheetTotal: 2; Version: 1.0; Variant: 5.3 A MOSFET; Modification: Mod; Project: Light Control
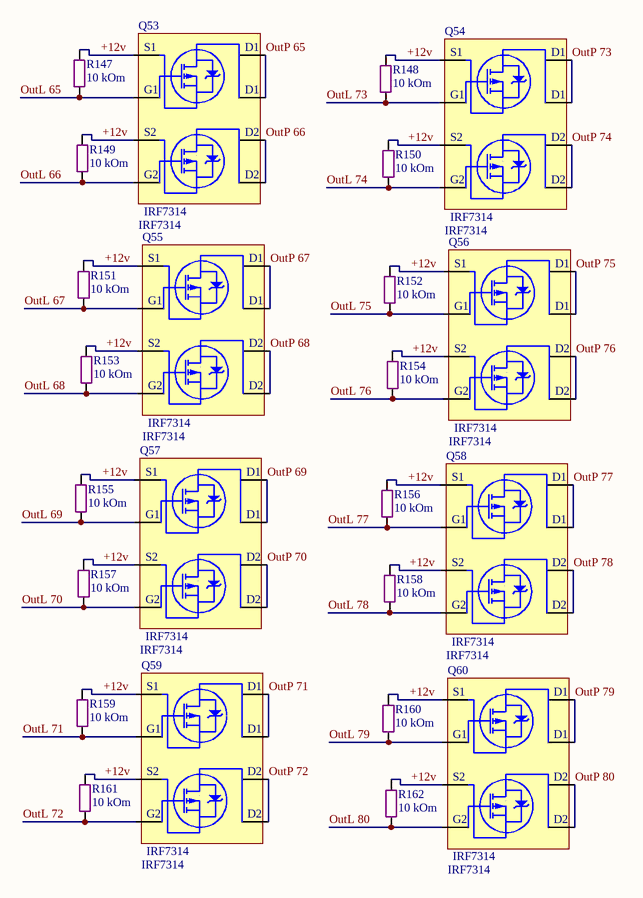
[diagram p5: LC BigOne - 5.3A MOSFET for TLC5940 3.SchDoc]

### Parts
Q53  IRF7314  [SO8]
Q54  IRF7314  [SO8]
Q55  IRF7314  [SO8]
Q56  IRF7314  [SO8]
Q57  IRF7314  [SO8]
Q58  IRF7314  [SO8]
Q59  IRF7314  [SO8]
Q60  IRF7314  [SO8]
R147  10 kOm  [SMD 0805 (2012)]
R148  10 kOm  [SMD 0805 (2012)]
R149  10 kOm  [SMD 0805 (2012)]
R150  10 kOm  [SMD 0805 (2012)]
R151  10 kOm  [SMD 0805 (2012)]
R152  10 kOm  [SMD 0805 (2012)]
R153  10 kOm  [SMD 0805 (2012)]
R154  10 kOm  [SMD 0805 (2012)]
R155  10 kOm  [SMD 0805 (2012)]
R156  10 kOm  [SMD 0805 (2012)]
R157  10 kOm  [SMD 0805 (2012)]
R158  10 kOm  [SMD 0805 (2012)]
R159  10 kOm  [SMD 0805 (2012)]
R160  10 kOm  [SMD 0805 (2012)]
R161  10 kOm  [SMD 0805 (2012)]
R162  10 kOm  [SMD 0805 (2012)]

### Nets
+12v: Q53.1(S) Q53.3(S) Q54.1(S) Q54.3(S) Q55.1(S) Q55.3(S) Q56.1(S) Q56.3(S) Q57.1(S) Q57.3(S) Q58.1(S) Q58.3(S) Q59.1(S) Q59.3(S) Q60.1(S) Q60.3(S) R147.2 R148.2 R149.2 R150.2 R151.2 R152.2 R153.2 R154.2 R155.2 R156.2 R157.2 R158.2 R159.2 R160.2 R161.2 R162.2
OutL 65: Q53.2(G) R147.1
OutL 66: Q53.4(G) R149.1
OutL 67: Q55.2(G) R151.1
OutL 68: Q55.4(G) R153.1
OutL 69: Q57.2(G) R155.1
OutL 70: Q57.4(G) R157.1
OutL 71: Q59.2(G) R159.1
OutL 72: Q59.4(G) R161.1
OutL 73: Q54.2(G) R148.1
OutL 74: Q54.4(G) R150.1
OutL 75: Q56.2(G) R152.1
OutL 76: Q56.4(G) R154.1
OutL 77: Q58.2(G) R156.1
OutL 78: Q58.4(G) R158.1
OutL 79: Q60.2(G) R160.1
OutL 80: Q60.4(G) R162.1
OutP 65: Q53.7(D) Q53.8(D)
OutP 66: Q53.5(D) Q53.6(D)
OutP 67: Q55.7(D) Q55.8(D)
OutP 68: Q55.5(D) Q55.6(D)
OutP 69: Q57.7(D) Q57.8(D)
OutP 70: Q57.5(D) Q57.6(D)
OutP 71: Q59.7(D) Q59.8(D)
OutP 72: Q59.5(D) Q59.6(D)
OutP 73: Q54.7(D) Q54.8(D)
OutP 74: Q54.5(D) Q54.6(D)
OutP 75: Q56.7(D) Q56.8(D)
OutP 76: Q56.5(D) Q56.6(D)
OutP 77: Q58.7(D) Q58.8(D)
OutP 78: Q58.5(D) Q58.6(D)
OutP 79: Q60.7(D) Q60.8(D)
OutP 80: Q60.5(D) Q60.6(D)

### Notes on the sheet
- Ver:
- Rev:
- Sheet
- of
- File:
- (in symbol IRF7314) S1; D1; G1; S2; D2; G2

### Library data of the parts
Q53-Q60 = IRF7314: as Q25 on sheet LC BigOne - TLC5940 driver; V DSS (v): 20V; I d - Drain current (continuous) at TC = 25°C: 5.3 A; Name: IRF7314; Datasheet: http://tec.org.ru/_bd/2/277_IRF7314-IR.pdf; URL: http://tec.org.ru/board/49-1-0-277
R147-R162 = Res All Types

## Nets that join several sheets
+5v: LC BigOne - MainBlock (14 pins), LC BigOne - TLC5940 driver (16 pins), LC BigOne - 165 SerialIn Register (v2) (51 pins)
GND: LC BigOne - MainBlock (17 pins), LC BigOne - TLC5940 driver (20 pins), LC BigOne - 165 SerialIn Register (v2) (30 pins), LC BigOne - Comm Connectors (6 pins)
+12v: LC BigOne - MainBlock (6 pins), LC BigOne - TLC5940 driver (Q25.1 Q25.3 R73.2 R74.2), LC BigOne - Comm Connectors (6 pins), LC BigOne - 5.3A MOSFET for TLC5940 2 (64 pins), LC BigOne - 5.3A MOSFET for TLC5940 3 (32 pins)
BLANK: LC BigOne - MainBlock (M1.D6), LC BigOne - TLC5940 driver (6 pins)
Bt 1: LC BigOne - 165 SerialIn Register (v2) (Q2.3 R65.1), LC BigOne - Comm Connectors (J15.16)
Bt 2: LC BigOne - 165 SerialIn Register (v2) (Q2.1 R47.1), LC BigOne - Comm Connectors (J15.15)
Bt 3: LC BigOne - 165 SerialIn Register (v2) (Q4.3 R69.1), LC BigOne - Comm Connectors (J15.13)
Bt 4: LC BigOne - 165 SerialIn Register (v2) (Q4.1 R67.1), LC BigOne - Comm Connectors (J15.14)
Bt 5: LC BigOne - 165 SerialIn Register (v2) (Q10.3 R11.1), LC BigOne - Comm Connectors (J14.16)
Bt 6: LC BigOne - 165 SerialIn Register (v2) (Q10.1 R9.1), LC BigOne - Comm Connectors (J14.15)
Bt 7: LC BigOne - 165 SerialIn Register (v2) (Q7.3 R15.1), LC BigOne - Comm Connectors (J14.13)
Bt 8: LC BigOne - 165 SerialIn Register (v2) (Q7.1 R13.1), LC BigOne - Comm Connectors (J14.14)
Bt 9: LC BigOne - 165 SerialIn Register (v2) (Q1.3 R48.1), LC BigOne - Comm Connectors (J12.16)
Bt 10: LC BigOne - 165 SerialIn Register (v2) (Q1.1 R46.1), LC BigOne - Comm Connectors (J12.15)
Bt 11: LC BigOne - 165 SerialIn Register (v2) (Q3.3 R68.1), LC BigOne - Comm Connectors (J12.13)
Bt 12: LC BigOne - 165 SerialIn Register (v2) (Q3.1 R66.1), LC BigOne - Comm Connectors (J12.14)
Bt 13: LC BigOne - 165 SerialIn Register (v2) (Q6.3 R12.1), LC BigOne - Comm Connectors (J10.16)
Bt 14: LC BigOne - 165 SerialIn Register (v2) (Q6.1 R70.1), LC BigOne - Comm Connectors (J10.15)
Bt 15: LC BigOne - 165 SerialIn Register (v2) (Q24.3 R72.1), LC BigOne - Comm Connectors (J10.13)
Bt 16: LC BigOne - 165 SerialIn Register (v2) (Q24.1 R71.1), LC BigOne - Comm Connectors (J10.14)
Bt 17: LC BigOne - 165 SerialIn Register (v2) (Q9.3 R79.1), LC BigOne - Comm Connectors (J13.20)
Bt 18: LC BigOne - 165 SerialIn Register (v2) (Q9.1 R78.1), LC BigOne - Comm Connectors (J13.15)
Bt 19: LC BigOne - 165 SerialIn Register (v2) (Q26.3 R81.1), LC BigOne - Comm Connectors (J13.10)
Bt 20: LC BigOne - 165 SerialIn Register (v2) (Q26.1 R80.1), LC BigOne - Comm Connectors (J13.5)
Bt 21: LC BigOne - 165 SerialIn Register (v2) (Q27.3 R83.1), LC BigOne - Comm Connectors (J11.20)
Bt 22: LC BigOne - 165 SerialIn Register (v2) (Q27.1 R82.1), LC BigOne - Comm Connectors (J11.15)
Bt 23: LC BigOne - 165 SerialIn Register (v2) (Q28.3 R93.1), LC BigOne - Comm Connectors (J11.10)
Bt 24: LC BigOne - 165 SerialIn Register (v2) (Q28.1 R90.1), LC BigOne - Comm Connectors (J11.5)
CLK165: LC BigOne - MainBlock (M1.D5), LC BigOne - 165 SerialIn Register (v2) (U3.2 U4.2 U7.2)
GSCLK: LC BigOne - MainBlock (M1.D3), LC BigOne - TLC5940 driver (5 pins)
Latch165: LC BigOne - MainBlock (M1.D2), LC BigOne - 165 SerialIn Register (v2) (U3.1 U4.1 U7.1)
OutL 33: LC BigOne - TLC5940 driver (J27.32 U8.28), LC BigOne - 5.3A MOSFET for TLC5940 2 (Q29.2 R99.1)
OutL 34: LC BigOne - TLC5940 driver (J27.31 U8.1), LC BigOne - 5.3A MOSFET for TLC5940 2 (Q29.4 R103.1)
OutL 35: LC BigOne - TLC5940 driver (J27.30 U8.2), LC BigOne - 5.3A MOSFET for TLC5940 2 (Q33.2 R107.1)
OutL 36: LC BigOne - TLC5940 driver (J27.29 U8.3), LC BigOne - 5.3A MOSFET for TLC5940 2 (Q33.4 R111.1)
OutL 37: LC BigOne - TLC5940 driver (J27.28 U8.4), LC BigOne - 5.3A MOSFET for TLC5940 2 (Q37.2 R115.1)
OutL 38: LC BigOne - TLC5940 driver (J27.27 U8.5), LC BigOne - 5.3A MOSFET for TLC5940 2 (Q37.4 R119.1)
OutL 39: LC BigOne - TLC5940 driver (J27.26 U8.6), LC BigOne - 5.3A MOSFET for TLC5940 2 (Q41.2 R123.1)
OutL 40: LC BigOne - TLC5940 driver (J27.25 U8.7), LC BigOne - 5.3A MOSFET for TLC5940 2 (Q41.4 R127.1)
OutL 41: LC BigOne - TLC5940 driver (J27.24 U8.8), LC BigOne - 5.3A MOSFET for TLC5940 2 (Q30.2 R100.1)
OutL 42: LC BigOne - TLC5940 driver (J27.23 U8.9), LC BigOne - 5.3A MOSFET for TLC5940 2 (Q30.4 R104.1)
OutL 43: LC BigOne - TLC5940 driver (J27.22 U8.10), LC BigOne - 5.3A MOSFET for TLC5940 2 (Q34.2 R108.1)
OutL 44: LC BigOne - TLC5940 driver (J27.21 U8.11), LC BigOne - 5.3A MOSFET for TLC5940 2 (Q34.4 R112.1)
OutL 45: LC BigOne - TLC5940 driver (J27.20 U8.12), LC BigOne - 5.3A MOSFET for TLC5940 2 (Q38.2 R116.1)
OutL 46: LC BigOne - TLC5940 driver (J27.19 U8.13), LC BigOne - 5.3A MOSFET for TLC5940 2 (Q38.4 R120.1)
OutL 47: LC BigOne - TLC5940 driver (J27.18 U8.14), LC BigOne - 5.3A MOSFET for TLC5940 2 (Q42.2 R124.1)
OutL 48: LC BigOne - TLC5940 driver (J27.17 U8.15), LC BigOne - 5.3A MOSFET for TLC5940 2 (Q42.4 R128.1)
OutL 49: LC BigOne - TLC5940 driver (J27.16 U10.28), LC BigOne - 5.3A MOSFET for TLC5940 2 (Q32.2 R102.1)
OutL 50: LC BigOne - TLC5940 driver (J27.15 U10.1), LC BigOne - 5.3A MOSFET for TLC5940 2 (Q32.4 R106.1)
OutL 51: LC BigOne - TLC5940 driver (J27.14 U10.2), LC BigOne - 5.3A MOSFET for TLC5940 2 (Q36.2 R110.1)
OutL 52: LC BigOne - TLC5940 driver (J27.13 U10.3), LC BigOne - 5.3A MOSFET for TLC5940 2 (Q36.4 R114.1)
OutL 53: LC BigOne - TLC5940 driver (J27.12 U10.4), LC BigOne - 5.3A MOSFET for TLC5940 2 (Q40.2 R118.1)
OutL 54: LC BigOne - TLC5940 driver (J27.11 U10.5), LC BigOne - 5.3A MOSFET for TLC5940 2 (Q40.4 R122.1)
OutL 55: LC BigOne - TLC5940 driver (J27.10 U10.6), LC BigOne - 5.3A MOSFET for TLC5940 2 (Q44.2 R126.1)
OutL 56: LC BigOne - TLC5940 driver (J27.9 U10.7), LC BigOne - 5.3A MOSFET for TLC5940 2 (Q44.4 R130.1)
OutL 57: LC BigOne - TLC5940 driver (J27.8 U10.8), LC BigOne - 5.3A MOSFET for TLC5940 2 (Q31.2 R101.1)
OutL 58: LC BigOne - TLC5940 driver (J27.7 U10.9), LC BigOne - 5.3A MOSFET for TLC5940 2 (Q31.4 R105.1)
OutL 59: LC BigOne - TLC5940 driver (J27.6 U10.10), LC BigOne - 5.3A MOSFET for TLC5940 2 (Q35.2 R109.1)
OutL 60: LC BigOne - TLC5940 driver (J27.5 U10.11), LC BigOne - 5.3A MOSFET for TLC5940 2 (Q35.4 R113.1)
OutL 61: LC BigOne - TLC5940 driver (J27.4 U10.12), LC BigOne - 5.3A MOSFET for TLC5940 2 (Q39.2 R117.1)
OutL 62: LC BigOne - TLC5940 driver (J27.3 U10.13), LC BigOne - 5.3A MOSFET for TLC5940 2 (Q39.4 R121.1)
OutL 63: LC BigOne - TLC5940 driver (J27.2 U10.14), LC BigOne - 5.3A MOSFET for TLC5940 2 (Q43.2 R125.1)
OutL 64: LC BigOne - TLC5940 driver (J27.1 U10.15), LC BigOne - 5.3A MOSFET for TLC5940 2 (Q43.4 R129.1)
OutL 65: LC BigOne - TLC5940 driver (J28.8 U9.28), LC BigOne - 5.3A MOSFET for TLC5940 3 (Q53.2 R147.1)
OutL 66: LC BigOne - TLC5940 driver (J28.7 U9.1), LC BigOne - 5.3A MOSFET for TLC5940 3 (Q53.4 R149.1)
OutL 67: LC BigOne - TLC5940 driver (J28.6 U9.2), LC BigOne - 5.3A MOSFET for TLC5940 3 (Q55.2 R151.1)
OutL 68: LC BigOne - TLC5940 driver (J28.5 U9.3), LC BigOne - 5.3A MOSFET for TLC5940 3 (Q55.4 R153.1)
OutL 69: LC BigOne - TLC5940 driver (J28.4 U9.4), LC BigOne - 5.3A MOSFET for TLC5940 3 (Q57.2 R155.1)
OutL 70: LC BigOne - TLC5940 driver (J28.3 U9.5), LC BigOne - 5.3A MOSFET for TLC5940 3 (Q57.4 R157.1)
OutL 71: LC BigOne - TLC5940 driver (J28.2 U9.6), LC BigOne - 5.3A MOSFET for TLC5940 3 (Q59.2 R159.1)
OutL 72: LC BigOne - TLC5940 driver (J28.1 U9.7), LC BigOne - 5.3A MOSFET for TLC5940 3 (Q59.4 R161.1)
OutL 73: LC BigOne - TLC5940 driver (J29.8 U9.8), LC BigOne - 5.3A MOSFET for TLC5940 3 (Q54.2 R148.1)
OutL 74: LC BigOne - TLC5940 driver (J29.7 U9.9), LC BigOne - 5.3A MOSFET for TLC5940 3 (Q54.4 R150.1)
OutL 75: LC BigOne - TLC5940 driver (J29.6 U9.10), LC BigOne - 5.3A MOSFET for TLC5940 3 (Q56.2 R152.1)
OutL 76: LC BigOne - TLC5940 driver (J29.5 U9.11), LC BigOne - 5.3A MOSFET for TLC5940 3 (Q56.4 R154.1)
OutL 77: LC BigOne - TLC5940 driver (J29.4 U9.12), LC BigOne - 5.3A MOSFET for TLC5940 3 (Q58.2 R156.1)
OutL 78: LC BigOne - TLC5940 driver (J29.3 U9.13), LC BigOne - 5.3A MOSFET for TLC5940 3 (Q58.4 R158.1)
OutL 79: LC BigOne - TLC5940 driver (J29.2 U9.14), LC BigOne - 5.3A MOSFET for TLC5940 3 (Q60.2 R160.1)
OutL 80: LC BigOne - TLC5940 driver (J29.1 U9.15), LC BigOne - 5.3A MOSFET for TLC5940 3 (Q60.4 R162.1)
OutP 1: LC BigOne - TLC5940 driver (Q25.7 Q25.8), LC BigOne - Comm Connectors (J11.1)
OutP 2: LC BigOne - TLC5940 driver (Q25.5 Q25.6), LC BigOne - Comm Connectors (J11.2)
OutP 33: LC BigOne - Comm Connectors (J10.1), LC BigOne - 5.3A MOSFET for TLC5940 2 (Q29.7 Q29.8)
OutP 34: LC BigOne - Comm Connectors (J10.2), LC BigOne - 5.3A MOSFET for TLC5940 2 (Q29.5 Q29.6)
OutP 35: LC BigOne - Comm Connectors (J10.3), LC BigOne - 5.3A MOSFET for TLC5940 2 (Q33.7 Q33.8)
OutP 36: LC BigOne - Comm Connectors (J10.4), LC BigOne - 5.3A MOSFET for TLC5940 2 (Q33.5 Q33.6)
OutP 37: LC BigOne - Comm Connectors (J10.5), LC BigOne - 5.3A MOSFET for TLC5940 2 (Q37.7 Q37.8)
OutP 38: LC BigOne - Comm Connectors (J10.6), LC BigOne - 5.3A MOSFET for TLC5940 2 (Q37.5 Q37.6)
OutP 39: LC BigOne - Comm Connectors (J10.7), LC BigOne - 5.3A MOSFET for TLC5940 2 (Q41.7 Q41.8)
OutP 40: LC BigOne - Comm Connectors (J10.8), LC BigOne - 5.3A MOSFET for TLC5940 2 (Q41.5 Q41.6)
OutP 41: LC BigOne - Comm Connectors (J10.9), LC BigOne - 5.3A MOSFET for TLC5940 2 (Q30.7 Q30.8)
OutP 42: LC BigOne - Comm Connectors (J10.10), LC BigOne - 5.3A MOSFET for TLC5940 2 (Q30.5 Q30.6)
OutP 43: LC BigOne - Comm Connectors (J10.11), LC BigOne - 5.3A MOSFET for TLC5940 2 (Q34.7 Q34.8)
OutP 44: LC BigOne - Comm Connectors (J10.12), LC BigOne - 5.3A MOSFET for TLC5940 2 (Q34.5 Q34.6)
OutP 45: LC BigOne - Comm Connectors (J12.1), LC BigOne - 5.3A MOSFET for TLC5940 2 (Q38.7 Q38.8)
OutP 46: LC BigOne - Comm Connectors (J12.2), LC BigOne - 5.3A MOSFET for TLC5940 2 (Q38.5 Q38.6)
OutP 47: LC BigOne - Comm Connectors (J12.3), LC BigOne - 5.3A MOSFET for TLC5940 2 (Q42.7 Q42.8)
OutP 48: LC BigOne - Comm Connectors (J12.4), LC BigOne - 5.3A MOSFET for TLC5940 2 (Q42.5 Q42.6)
OutP 49: LC BigOne - Comm Connectors (J12.5), LC BigOne - 5.3A MOSFET for TLC5940 2 (Q32.7 Q32.8)
OutP 50: LC BigOne - Comm Connectors (J12.6), LC BigOne - 5.3A MOSFET for TLC5940 2 (Q32.5 Q32.6)
OutP 51: LC BigOne - Comm Connectors (J12.7), LC BigOne - 5.3A MOSFET for TLC5940 2 (Q36.7 Q36.8)
OutP 52: LC BigOne - Comm Connectors (J12.8), LC BigOne - 5.3A MOSFET for TLC5940 2 (Q36.5 Q36.6)
OutP 53: LC BigOne - Comm Connectors (J12.9), LC BigOne - 5.3A MOSFET for TLC5940 2 (Q40.7 Q40.8)
OutP 54: LC BigOne - Comm Connectors (J12.10), LC BigOne - 5.3A MOSFET for TLC5940 2 (Q40.5 Q40.6)
OutP 55: LC BigOne - Comm Connectors (J12.11), LC BigOne - 5.3A MOSFET for TLC5940 2 (Q44.7 Q44.8)
OutP 56: LC BigOne - Comm Connectors (J12.12), LC BigOne - 5.3A MOSFET for TLC5940 2 (Q44.5 Q44.6)
OutP 57: LC BigOne - Comm Connectors (J14.1), LC BigOne - 5.3A MOSFET for TLC5940 2 (Q31.7 Q31.8)
OutP 58: LC BigOne - Comm Connectors (J14.2), LC BigOne - 5.3A MOSFET for TLC5940 2 (Q31.5 Q31.6)
OutP 59: LC BigOne - Comm Connectors (J14.3), LC BigOne - 5.3A MOSFET for TLC5940 2 (Q35.7 Q35.8)
OutP 60: LC BigOne - Comm Connectors (J14.4), LC BigOne - 5.3A MOSFET for TLC5940 2 (Q35.5 Q35.6)
OutP 61: LC BigOne - Comm Connectors (J14.5), LC BigOne - 5.3A MOSFET for TLC5940 2 (Q39.7 Q39.8)
OutP 62: LC BigOne - Comm Connectors (J14.6), LC BigOne - 5.3A MOSFET for TLC5940 2 (Q39.5 Q39.6)
OutP 63: LC BigOne - Comm Connectors (J14.7), LC BigOne - 5.3A MOSFET for TLC5940 2 (Q43.7 Q43.8)
OutP 64: LC BigOne - Comm Connectors (J14.8), LC BigOne - 5.3A MOSFET for TLC5940 2 (Q43.5 Q43.6)
OutP 65: LC BigOne - Comm Connectors (J14.9), LC BigOne - 5.3A MOSFET for TLC5940 3 (Q53.7 Q53.8)
OutP 66: LC BigOne - Comm Connectors (J14.10), LC BigOne - 5.3A MOSFET for TLC5940 3 (Q53.5 Q53.6)
OutP 67: LC BigOne - Comm Connectors (J14.11), LC BigOne - 5.3A MOSFET for TLC5940 3 (Q55.7 Q55.8)
OutP 68: LC BigOne - Comm Connectors (J14.12), LC BigOne - 5.3A MOSFET for TLC5940 3 (Q55.5 Q55.6)
OutP 69: LC BigOne - Comm Connectors (J15.1), LC BigOne - 5.3A MOSFET for TLC5940 3 (Q57.7 Q57.8)
OutP 70: LC BigOne - Comm Connectors (J15.2), LC BigOne - 5.3A MOSFET for TLC5940 3 (Q57.5 Q57.6)
OutP 71: LC BigOne - Comm Connectors (J15.3), LC BigOne - 5.3A MOSFET for TLC5940 3 (Q59.7 Q59.8)
OutP 72: LC BigOne - Comm Connectors (J15.4), LC BigOne - 5.3A MOSFET for TLC5940 3 (Q59.5 Q59.6)
OutP 73: LC BigOne - Comm Connectors (J15.5), LC BigOne - 5.3A MOSFET for TLC5940 3 (Q54.7 Q54.8)
OutP 74: LC BigOne - Comm Connectors (J15.6), LC BigOne - 5.3A MOSFET for TLC5940 3 (Q54.5 Q54.6)
OutP 75: LC BigOne - Comm Connectors (J15.7), LC BigOne - 5.3A MOSFET for TLC5940 3 (Q56.7 Q56.8)
OutP 76: LC BigOne - Comm Connectors (J15.8), LC BigOne - 5.3A MOSFET for TLC5940 3 (Q56.5 Q56.6)
OutP 77: LC BigOne - Comm Connectors (J15.9), LC BigOne - 5.3A MOSFET for TLC5940 3 (Q58.7 Q58.8)
OutP 78: LC BigOne - Comm Connectors (J15.10), LC BigOne - 5.3A MOSFET for TLC5940 3 (Q58.5 Q58.6)
OutP 79: LC BigOne - Comm Connectors (J15.11), LC BigOne - 5.3A MOSFET for TLC5940 3 (Q60.7 Q60.8)
OutP 80: LC BigOne - Comm Connectors (J15.12), LC BigOne - 5.3A MOSFET for TLC5940 3 (Q60.5 Q60.6)
SCLK: LC BigOne - MainBlock (M1.D4), LC BigOne - TLC5940 driver (5 pins)
SerialOut165: LC BigOne - MainBlock (M1.D8), LC BigOne - 165 SerialIn Register (v2) (U3.9)
SIn: LC BigOne - MainBlock (M1.D7), LC BigOne - TLC5940 driver (U5.26)
XLAT: LC BigOne - MainBlock (M1.D9), LC BigOne - TLC5940 driver (5 pins)